# EAGLE design 5VPart (EAGLE 9.6.2)
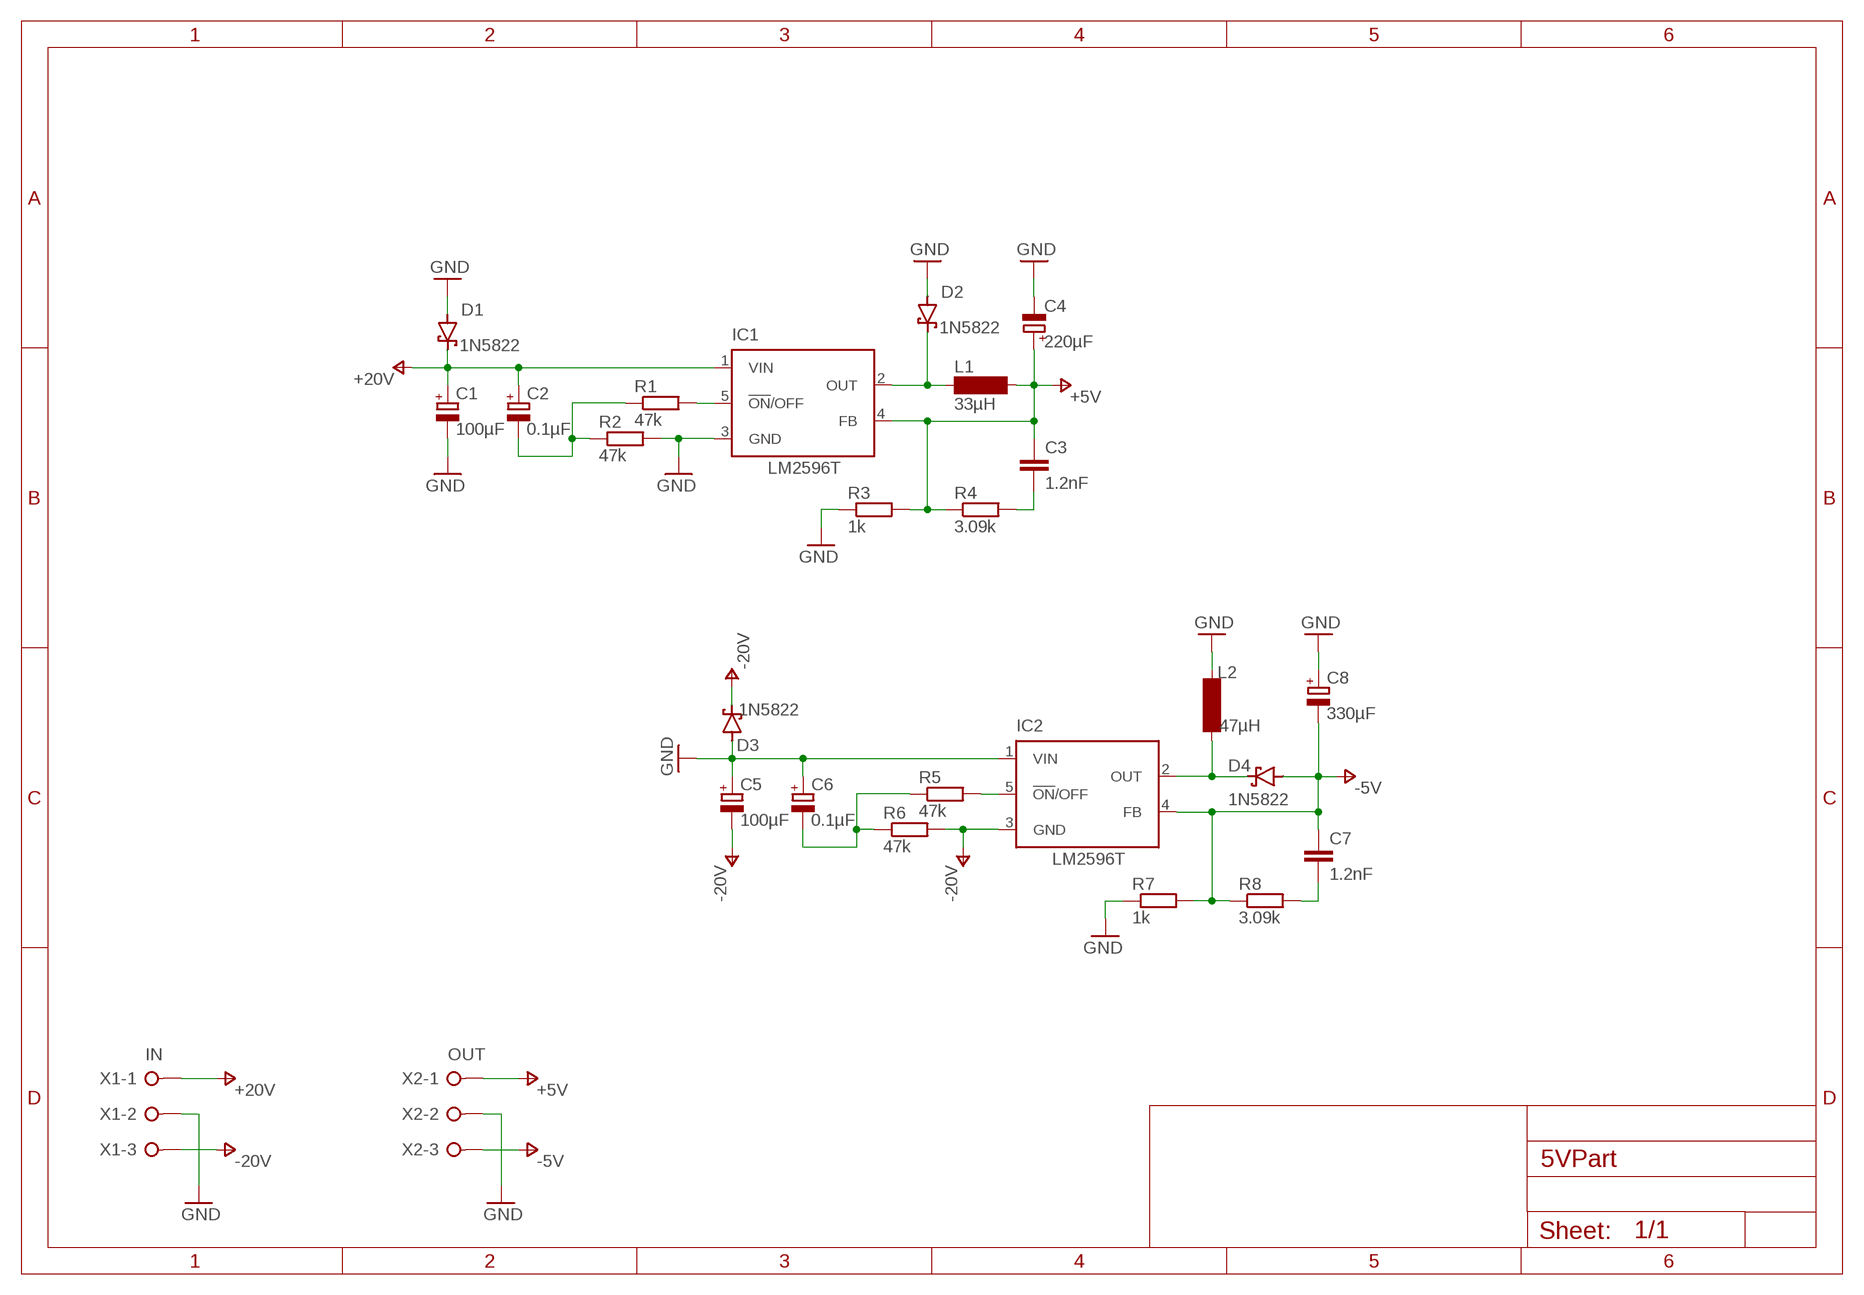
[diagram p0: schematic, sheet 1]

## Parts
C1  100µF  CPOL-EUE2.5-6  [E2,5-6]
C2  0.1µF  CPOL-EUE1.8-4  [E1,8-4]
C3  1.2nF  C-EU050-024X044  [C050-024X044]
C4  220µF  CPOL-EUE3.5-8  [E3,5-8]
C5  100µF  CPOL-EUE2.5-6  [E2,5-6]
C6  0.1µF  CPOL-EUE1.8-4  [E1,8-4]
C7  1.2nF  C-EU050-024X044  [C050-024X044]
C8  330µF  CPOL-EUE3.5-8  [E3,5-8]
D1  1N5822  SCHOTTKY-DIODEC4111-15  [C4111-15]
D2  1N5822  SCHOTTKY-DIODEC4111-15  [C4111-15]
D3  1N5822  SCHOTTKY-DIODEC4111-15  [C4111-15]
D4  1N5822  SCHOTTKY-DIODEC4111-15  [C4111-15]
IC1  LM2596T  [T05D]
IC2  LM2596T  [T05D]
L1  33µH  SD12-680  [SD12-680]
L2  47µH  SD12-680  [SD12-680]
R1  47k  R-EU_0207/10  [0207/10]
R2  47k  R-EU_0207/10  [0207/10]
R3  1k  R-EU_0207/10  [0207/10]
R4  3.09k  R-EU_0207/10  [0207/10]
R5  47k  R-EU_0207/10  [0207/10]
R6  47k  R-EU_0207/10  [0207/10]
R7  1k  R-EU_0207/10  [0207/10]
R8  3.09k  R-EU_0207/10  [0207/10]
X1  IN  W237-03P  [W237-133]
X2  OUT  W237-03P  [W237-133]

## Nets
+5V: C3.1 C4.+ IC1.4(FB) L1.2 R3.2 R4.1 X2.1
+20V: C1.+ C2.+ D1.C IC1.1(VIN) X1.1
-5V: C7.1 C8.- D4.A IC2.4(FB) R7.2 R8.1 X2.3
-20V: C5.- D3.C IC2.3(GND) R6.2 X1.3
GND: C1.- C4.- C5.+ C6.+ C8.+ D1.A D2.A D3.A IC1.3(GND) IC2.1(VIN) L2.2 R2.2 R3.1 R7.1 X1.2 X2.2
N$1: C3.2 R4.2
N$2: D4.C IC2.2(OUT) L2.1
N$3: D2.C IC1.2(OUT) L1.1
N$4: IC1.5(!ON!/OFF) R1.2
N$5: C7.2 R8.2
N$6: C2.- R1.1 R2.1
N$7: IC2.5(!ON!/OFF) R5.2
N$8: C6.- R5.1 R6.1

## Library data of the parts
C1 C2 C4-C6 C8 = rcl:CPOL-EU: POLARIZED CAPACITOR, European symbol; SPICEPREFIX: C
C3 C7 = rcl:C-EU: CAPACITOR, European symbol; SPICEPREFIX: C
D1-D4 = diode:SCHOTTKY-DIODE: Schottky Diode
IC1 IC2 = national-semiconductor:LM2596: SIMPLE SWITCHER® Power Converter 150 kHz 3A Step-Down Voltage Regulator Source: http://www.national.com/ds/LM/LM2596.pdf; MPN: LM2596T-ADJ/LF02; OC_FARNELL: 9494162; OC_NEWARK: 65K5910
L1 L2 = inductor-neosid:SD12: INDUCTOR nominal inductance; MF: BUSSMANN; MPN: SD12-680; OC_FARNELL: unknown; OC_NEWARK: 19K7201
R1-R8 = rcl:R-EU_: RESISTOR, European symbol; SPICEPREFIX: R
X1 X2 = con-wago-508:W237-03P: WAGO SREW CLAMP; OC_FARNELL: unknown; OC_NEWARK: unknown

## Board
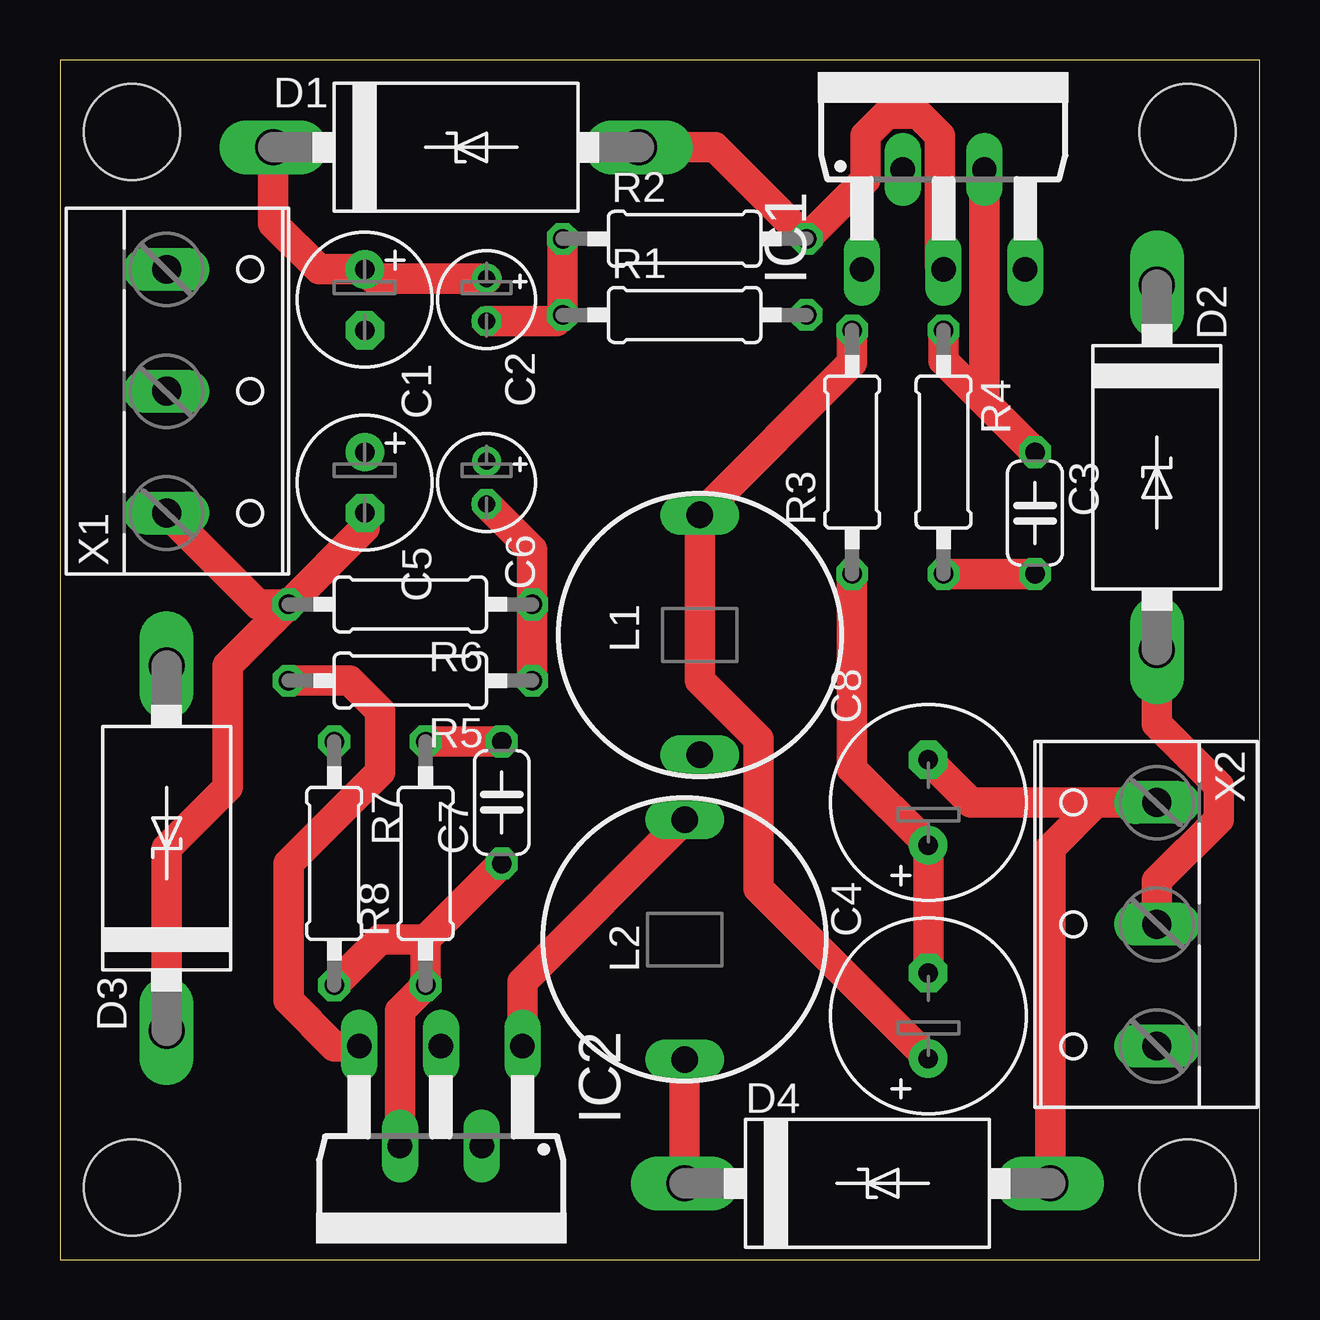
[diagram p1: board, top side]
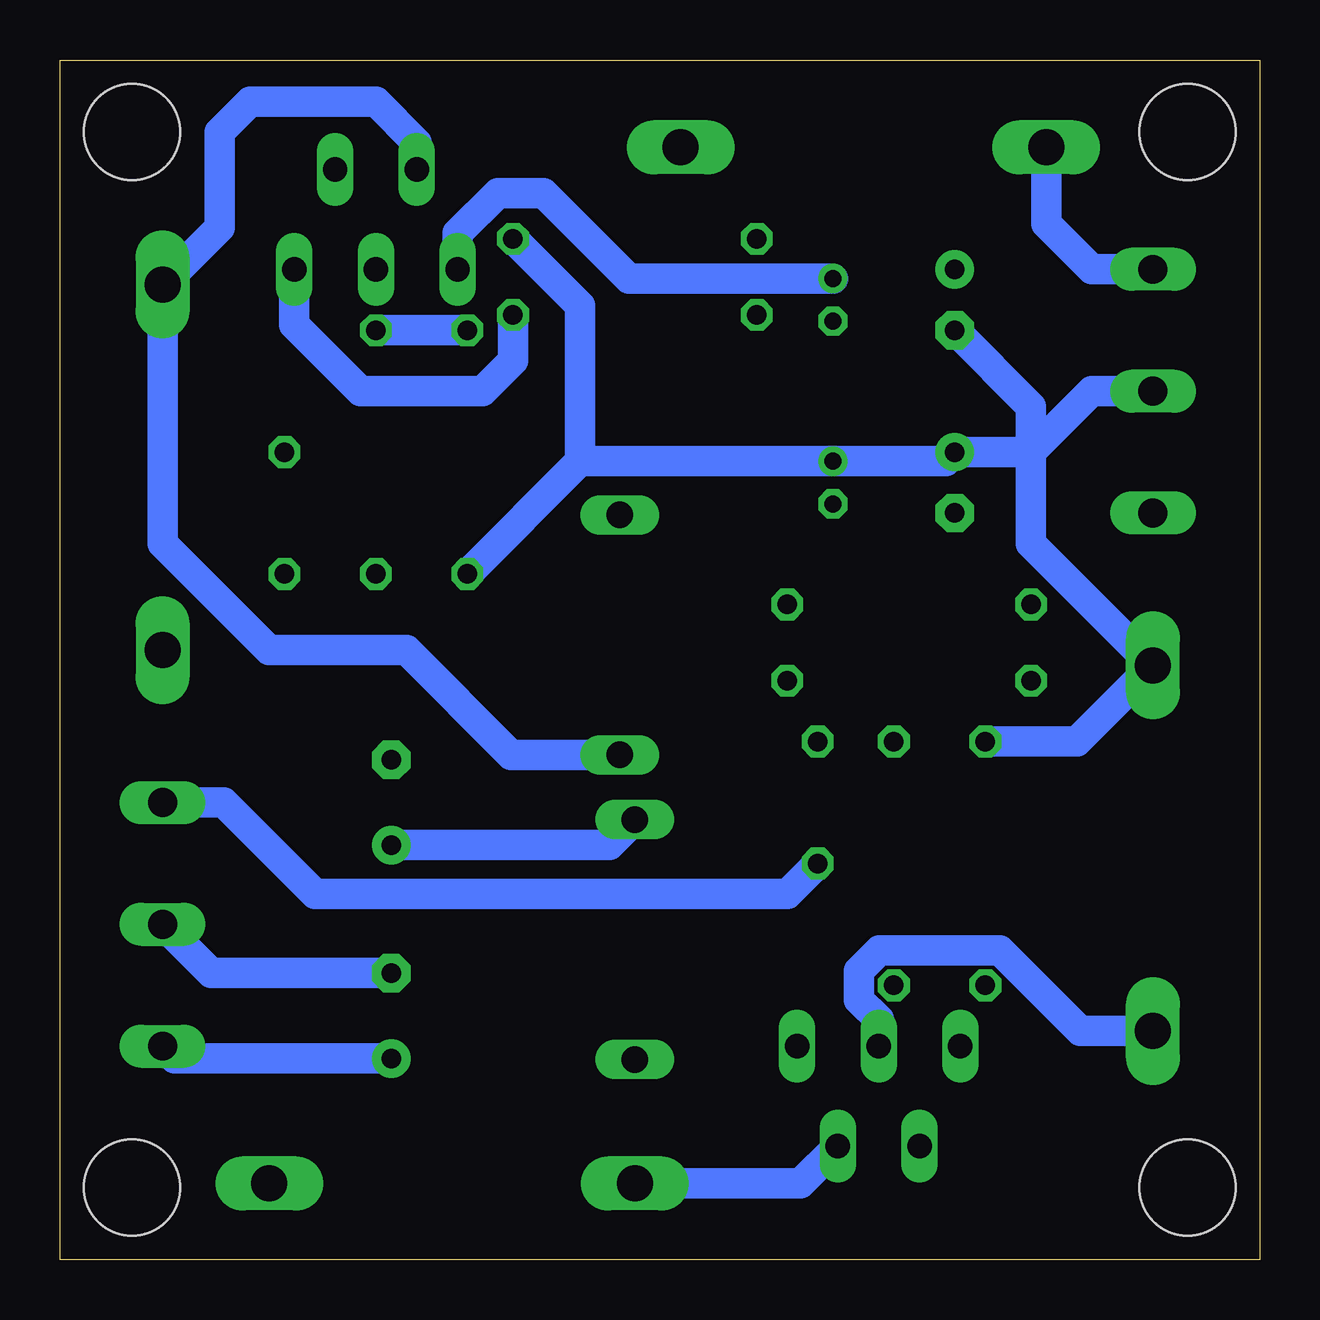
[diagram p2: board, bottom side, seen from below]

Size 50 x 50 mm. Coordinates in mm from the lower left corner, seen from the top.
Outline: 0,0 50,0 50,50 0,50 0,0
Copper layers (1*16): Top 0.035mm / dielectric 1.5mm / Bottom 0.035mm
Design rules "default *": minimum track width 50mil, minimum drill 0.5mm, track to track 6mil, track to pad 6mil, pad to pad 6mil, via to via 6mil, smd to smd 6mil, copper to edge 40mil, drill to drill 6mil, minimum pad ring 10mil, minimum via ring 8mil, stop-mask expansion 4mil, vias tented up to drill 0mil, thermal gap 10mil
Holes 4 mm at 3,3 3,47 47,3 47,47

### Footprints (pad centres in the part's own frame; a part is rotated, then mirrored left to right if it is on the bottom)
E2,5-6 = drill 0.813 pad 1.6: + -1.27,0 | drill 0.813 pad 1.6 octagon: - 1.27,0
E1,8-4 = drill 0.711 pad 1.168: + -0.889,0 | drill 0.711 pad 1.168 octagon: - 0.889,0
C050-024X044 = drill 0.813 octagon: 1 -2.54,0; 2 2.54,0
E3,5-8 = drill 0.813 pad 1.6: + -1.778,0 | drill 0.813 pad 1.6 octagon: - 1.778,0
C4111-15 = drill 1.499 long: A 7.62,0; C -7.62,0
T05D = drill 1.016 long: 1 -3.404,-5.08; 2 -1.702,-0.914; 3 0,-5.08; 4 1.702,-0.914; 5 3.404,-5.08
SD12-680 = drill 1.1 long: 1 -5,0; 2 5,0
0207/10 = drill 0.813 octagon: 1 -5.08,0; 2 5.08,0
W237-133 = drill 1.194 long: 1 -5.08,-0.635; 2 0,-0.635; 3 5.08,-0.635

### Placement (x,y rotation side)
C1  12.7,40.01 270 top
C2  17.78,40.01 270 top
C3  40.64,31.11 270 top
C4  36.2,10.16 90 top
C5  12.7,32.38 270 top
C6  17.78,32.38 270 top
C7  18.41,19.05 90 top
C8  36.2,19.05 90 top
D1  16.51,46.35 0 top
D2  45.72,33.02 270 top
D3  4.45,17.14 90 top
D4  33.66,3.17 0 top
IC1  36.83,46.35 0 top
IC2  15.88,3.81 180 top
L1  26.67,26.04 90 top
L2  26.04,13.34 90 top
R1  26.04,39.37 0 top
R2  26.04,42.55 0 top
R3  33.02,33.66 90 top
R4  36.83,33.66 270 top
R5  14.61,24.13 180 top
R6  14.61,27.3 180 top
R7  11.43,16.51 270 top
R8  15.24,16.51 90 top
X1  5.08,36.2 270 top
X2  45.09,13.97 90 top

### Tracks (layer width: path | path; a pad name or v marks a point on that pad's centre or on a via)
+5V
  Top 1.27: R4.1 36.83,37.47 C3.1 38.53,35.76 IC1.4 | R3.2 33.02,37.38 L1.2 26.67,24.14 29.11,21.7 29.11,15.47 C4.+
  Bottom 1.27: R3.2 R4.1 | X2.1 45.21,8.38 C4.+
+20V
  Top 1.27: 8.89,45.72 D1.C 8.89,43.18 10.79,41.27 C1.+ 13.08,40.89 C2.+
  Bottom 1.27: C2.+ 26.29,40.89 29.84,44.45 31.75,44.45 33.43,42.77 IC1.1 | D1.C 8.89,43.18 6.99,41.27 X1.1
-5V
  Top 1.27: IC2.4 14.17,10.36 R8.1 15.24,13.34 | 15.24,13.34 C7.1 | 43.18,19.05 37.97,19.05 C8.- | 43.18,19.05 X2.3 | 43.18,19.05 41.27,17.14 D4.A | R7.2 13.34,13.34 15.24,13.34
  Bottom 1.27: X2.3 43.18,19.05 39.37,15.24 19.68,15.24 C7.1
-20V
  Top 1.27: D3.C 4.45,17.14 6.99,19.68 6.99,24.77 R6.2 | R6.2 12.7,30.48 C5.- | R6.2 8.26,27.3 X1.3
  Bottom 1.27: IC2.3 15.88,10.02 16.69,10.83 16.69,12.03 15.84,12.88 10.83,12.88 7.48,9.53 D3.C
GND
  Top 1.27: IC2.1 19.28,11.58 L2.2 | C4.- C8.+ 33.02,20.45 R3.1 | IC1.3 36.68,41.43 36.68,46.84 35.77,47.75 34.49,47.75 33.58,46.84 33.58,45.01 R2.2 27.3,46.35 D1.A | D2.A 45.72,22.32 48.3,19.75 48.3,18.35 45.72,15.78 X2.2
  Bottom 1.27: C4.- 43.69,11.94 X2.2 | C8.+ 27.1,17.27 L2.2 | 28.32,33.27 C6.+ 13.08,33.27 C5.+ 9.53,33.66 | 28.32,33.27 R3.1 | R2.2 28.32,39.75 28.32,33.27 | R7.1 7.62,21.59 D3.A 9.53,29.84 9.53,33.66 | 9.53,33.66 6.99,36.2 X1.2 | C1.- 9.53,35.56 9.53,33.66
N$1
  Top 1.27: R4.2 C3.2
N$2
  Top 1.27: D4.C L2.1
  Bottom 1.27: D4.C 19.13,3.17 IC2.2
N$3
  Bottom 1.27: L1.1 31.2,21.04 35.56,25.4 41.27,25.4 45.72,29.84 D2.C 43.35,43.01 43.35,46.99 42.08,48.26 36.83,48.26 35.13,46.56 IC1.2
N$4
  Bottom 1.27: R1.2 31.11,37.47 32.38,36.2 37.47,36.2 40.23,38.96 IC1.5
N$5
  Top 1.27: C7.2 R8.2
N$6
  Top 1.27: C2.- 20.7,39.12 R1.1 R2.1
N$7
  Top 1.27: R5.2 12.06,24.13 13.34,22.86 13.34,20.32 9.53,16.51 9.53,10.79 11.43,8.89 IC2.5
N$8
  Top 1.27: R5.1 R6.1 19.68,29.59 C6.-